# Altium schematic sheet drvinput0.SchDoc
size A4
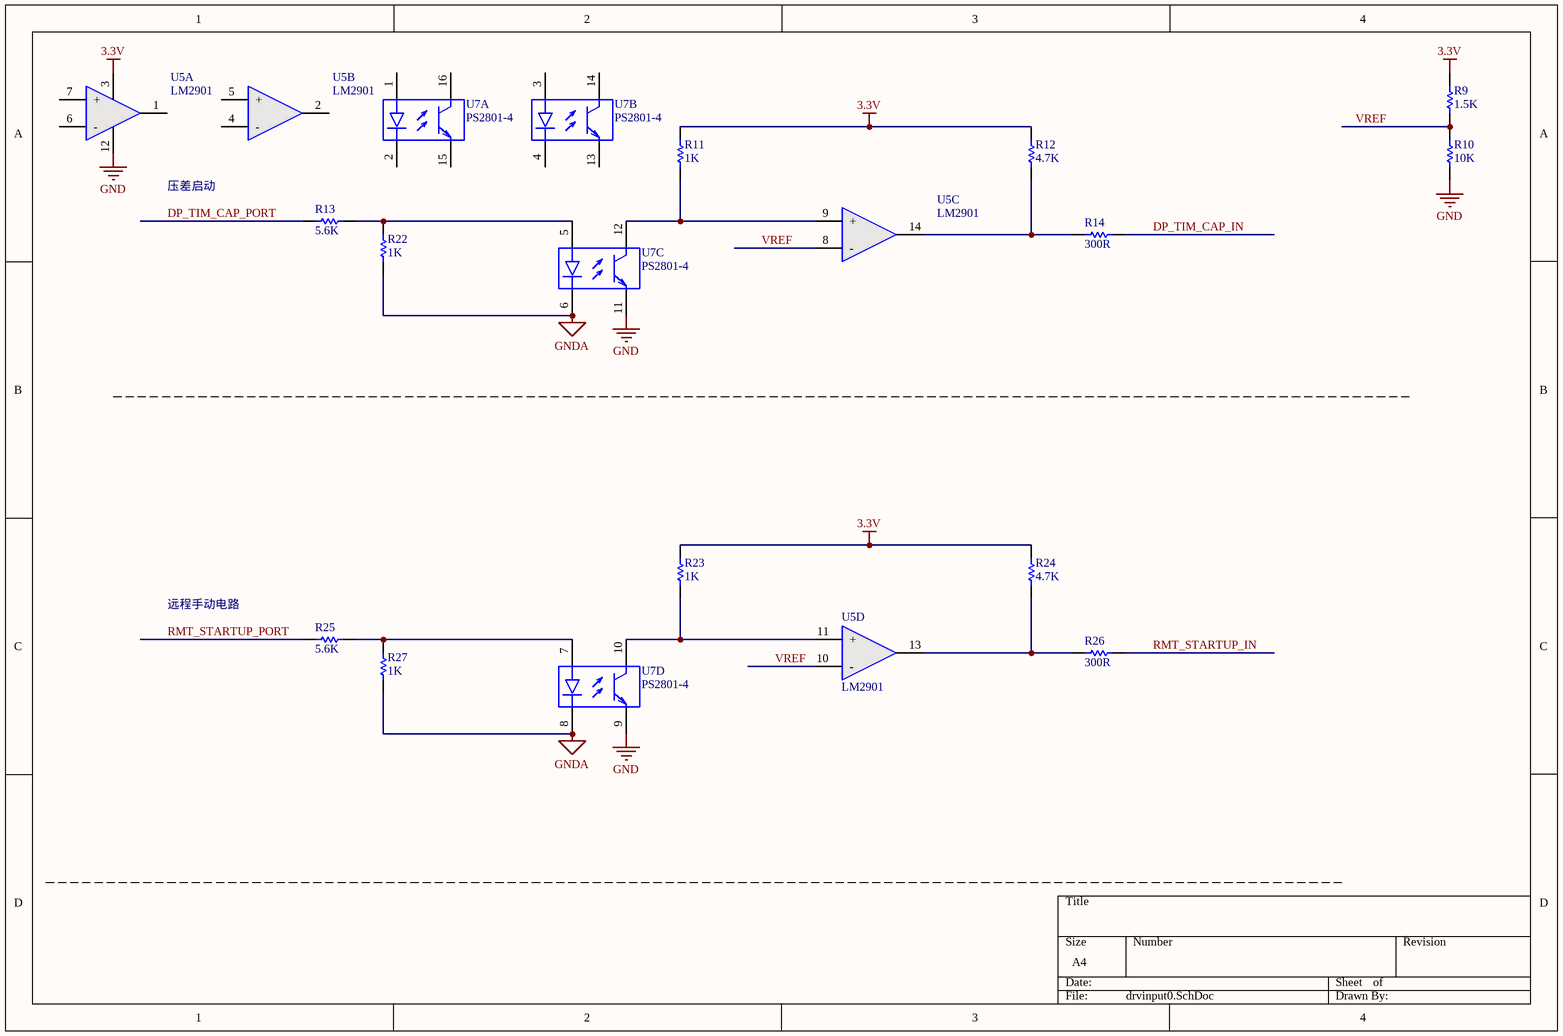
[diagram p0: drvinput0.SchDoc]

## Parts
R9  1.5K  [RESC2012M]
R10  10K  [RESC2012M]
R11  1K  [RESC2012M]
R12  4.7K  [RESC2012M]
R13  5.6K  [RESC2012M]
R14  300R  [RESC2012M]
R22  1K  [RESC2012M]
R23  1K  [RESC2012M]
R24  4.7K  [RESC2012M]
R25  5.6K  [RESC2012M]
R26  300R  [RESC2012M]
R27  1K  [RESC2012M]
U5  LM2901  [SOIC-14AM]  (parts A,B,C,D of 4)
U7  PS2801-4  [SOIC16_N]  (parts A,B,C,D of 4)

## Nets
3.3V: R9.1 R11.1 R12.2 R23.1 R24.2 U5.3(V+)
GND: R10.2 U5.12(V-) U7.9(E) U7.11(E)
GNDA: R22.1 R27.1 U7.6(-) U7.8(-)
DP_TIM_CAP_IN: R14.1
DP_TIM_CAP_PORT: R13.2
RMT_STARTUP_IN: R26.2
RMT_STARTUP_PORT: R25.2
VREF: R9.2 R10.1 U5.8(-) U5.10(-)
NetR11_2: R11.2 U5.9(+) U7.12(C)
NetR12_1: R12.1 R14.2 U5.14(OUT)
NetR13_1: R13.1 R22.2 U7.5(+)
NetR23_2: R23.2 U5.11(+) U7.10(C)
NetR24_1: R24.1 R26.1 U5.13(OUT)
NetR25_1: R25.1 R27.2 U7.7(+)

Not connected (* = marked no-connect by the designer): U5 1(OUT) 2(OUT) 4(-) 5(+) 6(-) 7(+); U7 1(+) 2(-) 3(+) 4(-) 13(E) 14(C) 15(E) 16(C)

## Notes on the sheet
- 压差启动
- 远程手动电路

## Library data of the parts
R9 R11-R14 R22-R25 R27 = Res1: Resistor; Value: 10K; Published: 8-Jun-2000; LatestRevisionDate: 17-Jul-2002; LatestRevisionNote: Re-released for DXP Platform.; PackageReference: AXIAL-0.3; Publisher: Altium Limited
R10 = Res1: Resistor; Published: 8-Jun-2000; LatestRevisionDate: 17-Jul-2002; LatestRevisionNote: Re-released for DXP Platform.; PackageReference: AXIAL-0.3; Publisher: Altium Limited; Value: 10K
R26 = Res1: Resistor; Value: 470; Published: 8-Jun-2000; LatestRevisionDate: 17-Jul-2002; LatestRevisionNote: Re-released for DXP Platform.; PackageReference: AXIAL-0.3; Publisher: Altium Limited
U5 = LM2901: 4通道差分比较器芯片
U7 = PS2801-4: The PS2801-1 and PS2801-4 are optically coupled isolators containing a GaAs light emitting diode and an NPN  silicon phototransistor in a plastic SOP for high density applications.; Published: 28-Feb-2003; LatestRevisionDate: 13-Apr-2006; LatestRevisionNote: IPC-7351 Footprint Added.; DatasheetVersion: Jan-2002, Rev. 7; PackageVersion: rev7, Jan-2002; PackageReference: 751-07; Publisher: Altium Limited; PackageDescription: 8-Pin Plastic Small Outline Integrated Circuit 1.27 mm Pitch; Code_JEDEC: MS-012-AA; Code_IPC: SOIC127P600-8; ComponentLink1Description: Manufacturer Link; ComponentLink1URL: http://www.onsemi.com/; ComponentLink2Description: Datasheet; ComponentLink2URL: http://www.onsemi.com/pub/Collateral/LM358-D.PDF